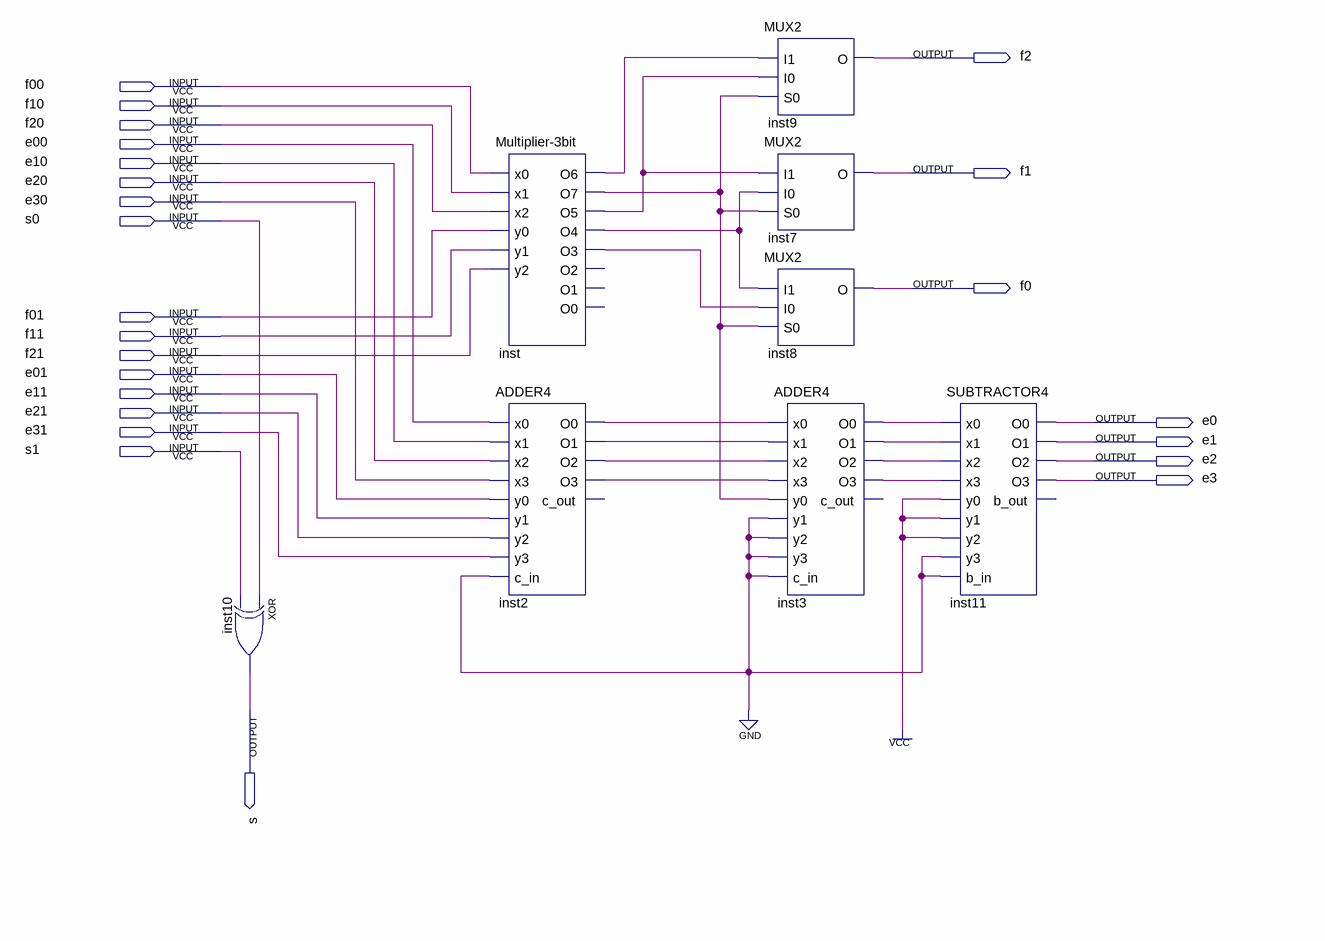
[diagram p0: schematic sheet]
// Quartus schematic Multiplier.bdf as structural Verilog: 8 symbols, 24 pins
module Multiplier (
  input  f00,
  input  f10,
  input  f20,
  input  e00,
  input  e10,
  input  e20,
  input  e30,
  input  s0,
  input  f01,
  input  f11,
  input  f21,
  input  e01,
  input  e11,
  input  e21,
  input  e31,
  input  s1,
  output f2,
  output f1,
  output f0,
  output e0,
  output e1,
  output e2,
  output e3,
  output s
);

  wire inst2_o0, inst2_o1, inst2_o2, inst2_o3, inst3_o0, inst3_o1, inst3_o2, inst3_o3, inst_o3, inst_o4,
       inst_o5, inst_o6, inst_o7;

  xor inst10 (s, s0, s1);
  \Multiplier-3bit  inst (
    .x0(f00), .x1(f10), .x2(f20), .y0(f01), .y1(f11), .y2(f21), .O6(inst_o6), .O7(inst_o7), .O5(inst_o5),
    .O4(inst_o4), .O3(inst_o3));  // open: O2, O1, O0
  ADDER4 inst2 (
    .x0(e00), .x1(e10), .x2(e20), .x3(e30), .y0(e01), .y1(e11), .y2(e21), .y3(e31), .c_in(1'b0),
    .O0(inst2_o0), .O1(inst2_o1), .O2(inst2_o2), .O3(inst2_o3));  // open: c_out
  MUX2 inst9 (.I1(inst_o6), .I0(inst_o5), .S0(inst_o7), .O(f2));
  MUX2 inst7 (.I1(inst_o5), .I0(inst_o4), .S0(inst_o7), .O(f1));
  MUX2 inst8 (.I1(inst_o4), .I0(inst_o3), .S0(inst_o7), .O(f0));
  ADDER4 inst3 (
    .x0(inst2_o0), .x1(inst2_o1), .x2(inst2_o2), .x3(inst2_o3), .y0(inst_o7), .y1(1'b0), .y2(1'b0),
    .y3(1'b0), .c_in(1'b0), .O0(inst3_o0), .O1(inst3_o1), .O2(inst3_o2), .O3(inst3_o3));  // open: c_out
  SUBTRACTOR4 inst11 (
    .x0(inst3_o0), .x1(inst3_o1), .x2(inst3_o2), .x3(inst3_o3), .y0(1'b1), .y1(1'b1), .y2(1'b1), .y3(1'b0),
    .b_in(1'b0), .O0(e0), .O1(e1), .O2(e2), .O3(e3));  // open: b_out
endmodule
